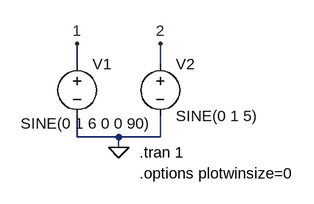
[diagram p0: schematic Fig_4-16_Lisa_Plot_Procedure.asc]
Fig_4-16_Lisa_Plot_Procedure.asc, the LTspice schematic file:
Version 4
SHEET 1 880 680
WIRE 96 144 96 112
WIRE 224 144 224 112
WIRE 96 256 96 224
WIRE 160 256 96 256
WIRE 224 256 224 224
WIRE 224 256 160 256
WIRE 160 272 160 256
FLAG 160 272 0
FLAG 96 112 1
FLAG 224 112 2
SYMBOL voltage 96 128 R0
WINDOW 3 -87 107 Left 2
WINDOW 123 0 0 Left 2
WINDOW 39 0 0 Left 2
SYMATTR Value SINE(0 1 6 0 0 90)
SYMATTR InstName V1
SYMBOL voltage 224 128 R0
WINDOW 123 0 0 Left 2
WINDOW 39 0 0 Left 2
SYMATTR InstName V2
SYMATTR Value SINE(0 1 5)
TEXT 192 280 Left 2 !.tran 1
TEXT 192 312 Left 2 !.options plotwinsize=0

The netlist it stands for:
* Fig_4-16_Lisa_Plot_Procedure.asc
V1 1 0 SINE(0 1 6 0 0 90)
V2 2 0 SINE(0 1 5)
.tran 1
.options plotwinsize=0
.backanno
.end